# EAGLE design ZxUartAdapter (EAGLE 9.2.2)
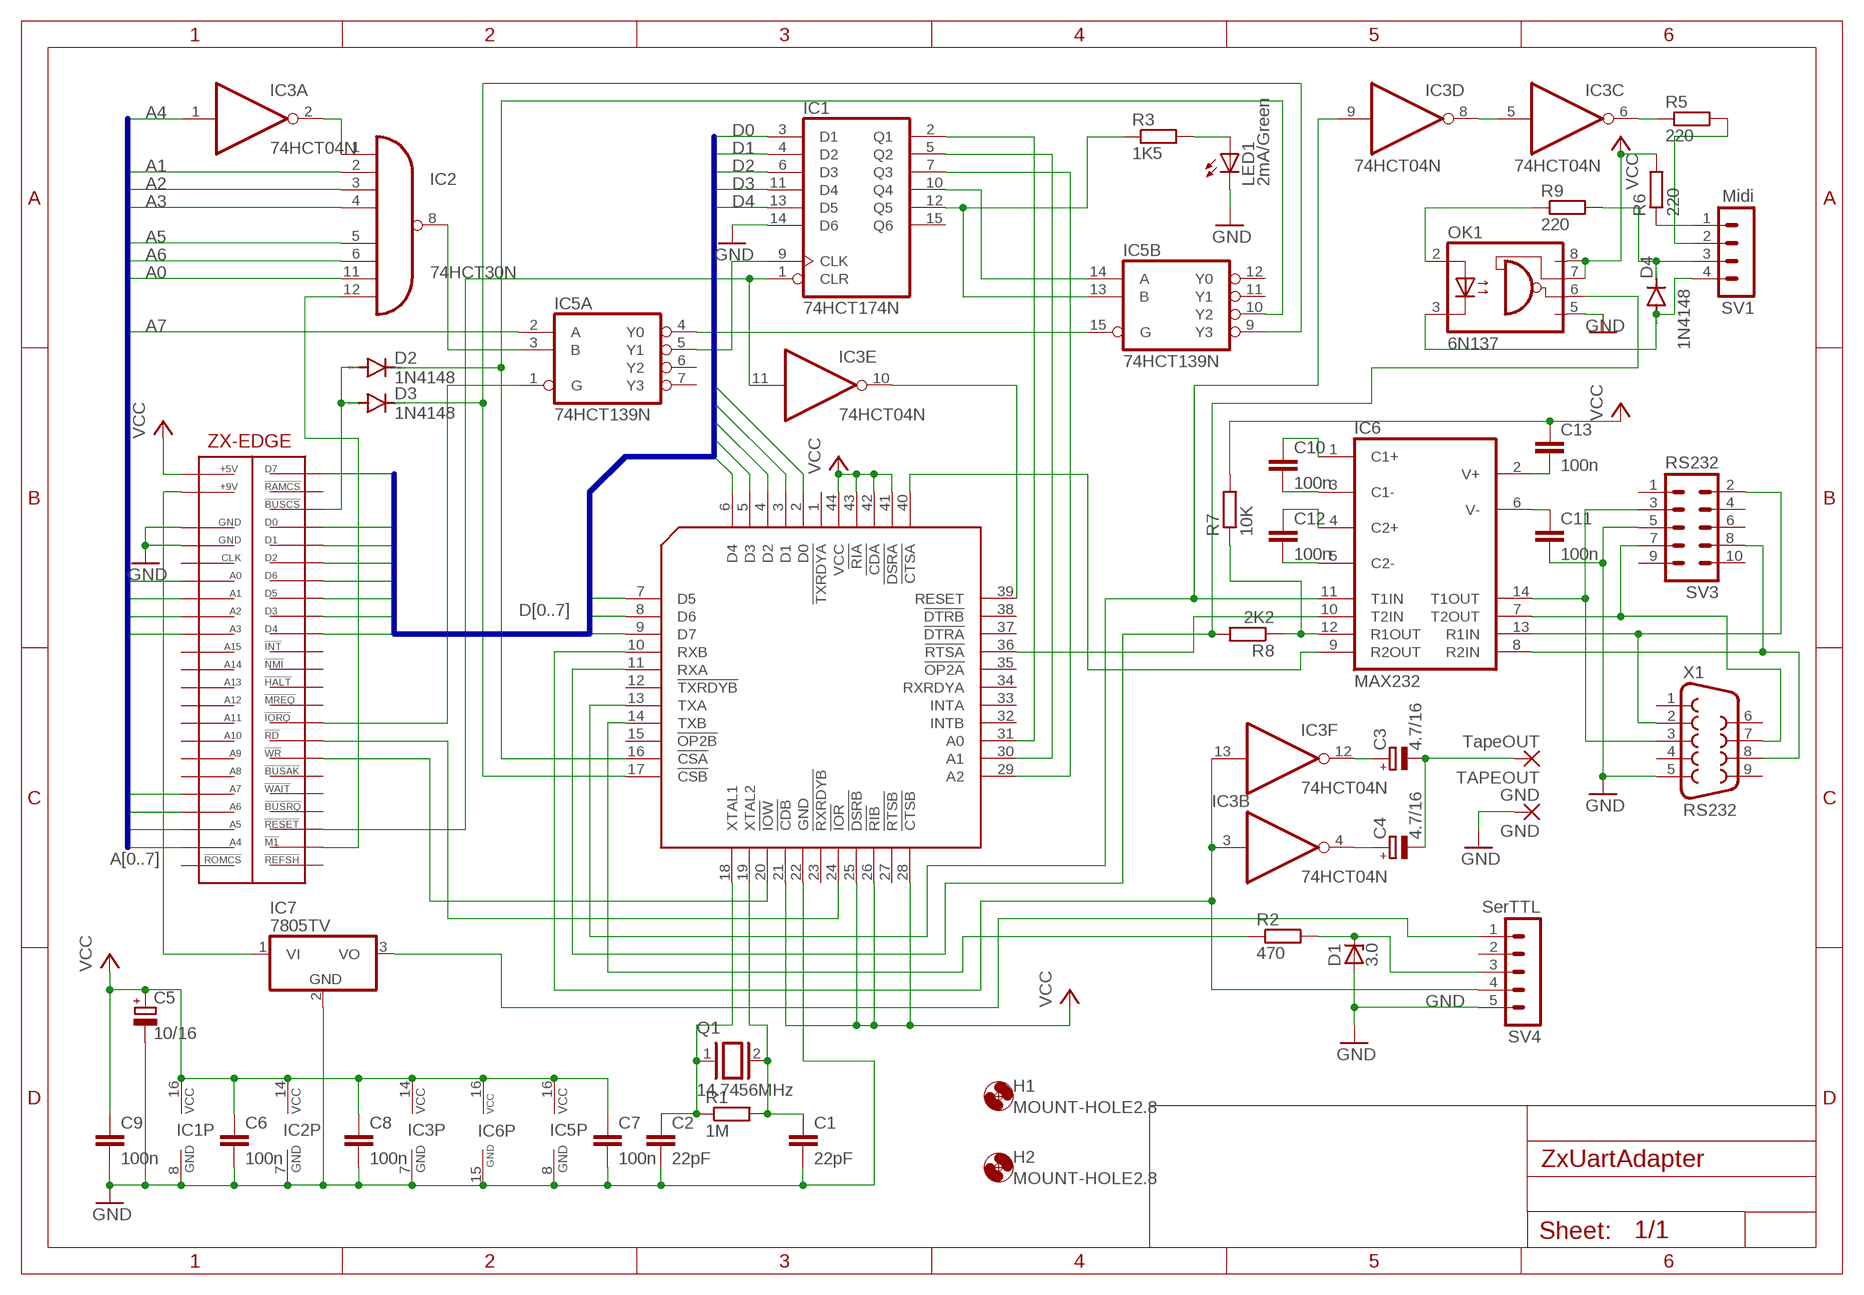
[diagram p0: schematic, sheet 1]

## Parts
C1  22pF  C-EU025-025X050  [C025-025X050]
C2  22pF  C-EU025-025X050  [C025-025X050]
C3  4.7/16  CPOL-EUE5-5  [E5-5]
C4  4.7/16  CPOL-EUE5-5  [E5-5]
C5  10/16  CPOL-EUE5-6  [E5-6]
C6  100n  C-EU050-024X044  [C050-024X044]
C7  100n  C-EU050-024X044  [C050-024X044]
C8  100n  C-EU050-024X044  [C050-024X044]
C9  100n  C-EU050-024X044  [C050-024X044]
C10  100n  C-EU050-024X044  [C050-024X044]
C11  100n  C-EU050-024X044  [C050-024X044]
C12  100n  C-EU050-024X044  [C050-024X044]
C13  100n  C-EU050-024X044  [C050-024X044]
D1  3.0  ZENER-DIODEZD-7.5  [ZDIO-7.5]
D2  1N4148  1N4148DO35-7  [DO35-7]
D3  1N4148  1N4148DO35-7  [DO35-7]
D4  1N4148  1N4148DO35-7  [DO35-7]
GND  GND  2,15/1,0  [2,15/1,0]
H1  MOUNT-HOLE2.8  [2,8]
H2  MOUNT-HOLE2.8  [2,8]
IC1  74HCT174N  [DIL16]
IC2  74HCT30N  [DIL14]
IC3  74HCT04N  [DIL14]
IC4  XR16C2850  XR16C2850PLCC44S  [S44]
IC5  74HCT139N  [DIL16]
IC6  MAX232  [DIL16]
IC7  7805TV  [TO220V]
LED1  2mA/Green  LED3MM  [LED3MM]
OK1  6N137  [DIL08]
Q1  14.7456MHz  XTAL/S  [QS]
R1  1M  R-EU_0207/12  [0207/12]
R2  470  R-EU_0207/12  [0207/12]
R3  1K5  R-EU_0207/12  [0207/12]
R5  220  R-EU_0207/12  [0207/12]
R6  220  R-EU_0207/12  [0207/12]
R7  10K  R-EU_0207/12  [0207/12]
R8  2K2  R-EU_0207/12  [0207/12]
R9  220  R-EU_0207/12  [0207/12]
SV1  Midi  MA04-1  [MA04-1]
SV3  RS232  MA05-2  [MA05-2]
SV4  SerTTL  MA05-1  [MA05-1]
TAPEOUT  TapeOUT  2,15/1,0  [2,15/1,0]
U$1  ZX-EDGEZX96  [ZX-EDGE64]
X1  RS232  F09HP  [F09HP]

## Nets
A0: IC2.11(I6) U$1.A21(A0)
A1: IC2.2(I1) U$1.A20(A1)
A2: IC2.3(I2) U$1.A19(A2)
A3: IC2.4(I3) U$1.A18(A3)
A4: IC3.1(A:I) U$1.A6(A4)
A5: IC2.5(I4) U$1.A7(A5)
A6: IC2.6(I5) U$1.A8(A6)
A7: IC5.2(A:A) U$1.A9(A7)
D0: IC1.3(D1) IC4.2(D0) U$1.C24(D0)
D1: IC1.4(D2) IC4.3(D1) U$1.C23(D1)
D2: IC1.6(D3) IC4.4(D2) U$1.C22(D2)
D3: IC1.11(D4) IC4.5(D3) U$1.C19(D3)
D4: IC1.13(D5) IC4.6(D4) U$1.C18(D4)
D5: IC4.7(D5) U$1.C20(D5)
D6: IC4.8(D6) U$1.C21(D6)
D7: IC4.9(D7) U$1.C27(D7)
GND: C1.2 C2.2 C5.- C6.2 C7.2 C8.2 C9.2 C11.2 D1.A GND.1(P) IC1.8(GND) IC1.14(D6) IC2.7(GND) IC3.7(P:GND) IC4.22(GND) IC5.8(P:GND) IC6.15(GND) IC7.2(GND) LED1.K(C) OK1.5(GND) SV3.5 SV4.5 U$1.A23(GND2) U$1.A24(GND1) X1.5
N$1: IC2.1(I0) IC3.2(A:O)
N$2: IC2.12(I7) U$1.C6(!M1)
N$3: IC5.1(A:G) U$1.C13(!IORQ)
N$4: IC2.8(O) IC5.3(A:B)
N$5: IC1.9(CLK) IC5.5(A:Y1)
N$6: IC5.4(A:Y0) IC5.15(B:G)
N$7: IC1.10(Q4) IC5.14(B:A)
N$8: IC1.12(Q5) IC5.13(B:B) R3.1
N$9: IC1.1(CLR) IC3.11(E:I) U$1.C7(!RESET)
N$10: C13.2 IC6.2(V+)
N$11: IC1.2(Q1) IC4.31(A0)
N$12: IC1.5(Q2) IC4.30(A1)
N$13: IC1.7(Q3) IC4.29(A2)
N$14: C11.1 IC6.6(V-)
N$15: IC3.10(E:O) IC4.39(RESET)
N$16: D2.C IC4.16(!CSA) IC5.10(B:Y2)
N$17: D3.C IC4.17(!CSB) IC5.9(B:Y3)
N$18: IC4.20(!IOW) U$1.C11(!WR)
N$19: IC4.24(!IOR) U$1.C12(!RD)
N$20: C1.1 IC4.19(XTAL2) Q1.2 R1.2
N$21: C2.1 IC4.18(XTAL1) Q1.1 R1.1
N$22: D2.A D3.A U$1.C25(!BUSCS)
N$23: C10.2 IC6.3(C1-)
N$24: C10.1 IC6.1(C1+)
N$25: C12.2 IC6.5(C2-)
N$26: C12.1 IC6.4(C2+)
N$27: IC4.14(TXB) R2.1
N$28: IC6.13(R1IN) SV3.2 X1.2
N$29: IC3.9(D:I) IC4.13(TXA) IC6.11(T1IN)
N$30: IC3.5(C:I) IC3.8(D:O)
N$31: D4.A OK1.3(C) SV1.4
N$32: IC3.6(C:O) R5.1
N$33: R6.1 SV1.1
N$34: R5.2 SV1.2
N$35: IC4.11(RXA) OK1.6(VO) R8.2
N$36: IC6.12(R1OUT) R7.1 R8.1
N$37: OK1.2(A) R9.1
N$38: D4.C R9.2 SV1.3
N$39: C3.+ IC3.12(F:O)
N$40: C4.+ IC3.4(B:O)
N$41: C3.- C4.- TAPEOUT.1(P)
N$42: IC3.3(B:I) IC3.13(F:I) IC4.10(RXB) SV4.4
N$43: D1.C R2.2 SV4.3
N$44: IC4.36(!RTSA) IC6.10(T2IN)
N$46: IC6.14(T1OUT) SV3.3 X1.3
N$47: IC6.7(T2OUT) SV3.7 X1.7
N$50: IC6.8(R2IN) SV3.8 X1.8
N$51: IC4.40(!CTSA) IC6.9(R2OUT)
N$52: LED1.A R3.2
N$54: IC7.1(VI) U$1.A26(+9)
N$55: IC7.3(VO) SV4.1
VCC: C5.+ C6.1 C7.1 C8.1 C9.1 C13.1 IC1.16(VCC) IC2.14(VCC) IC3.14(P:VCC) IC4.21(!CDB) IC4.25(!DSRB) IC4.26(!RIB) IC4.28(!CTSB) IC4.41(!DSRA) IC4.42(!CDA) IC4.43(!RIA) IC4.44(VCC) IC5.16(P:VCC) IC6.16(VCC) OK1.7(VE) OK1.8(VCC) R6.2 R7.2 U$1.A27(+5)
Unconnected: IC1.15(Q6) IC4.1(!TXRDYA) IC4.12(!TXRDYB) IC4.15(!OP2B) IC4.23(!RXRDYB) IC4.27(!RTSB) IC4.32(INTB) IC4.33(INTA) IC4.34(RXRDYA) IC4.35(!OP2A) IC4.37(!DTRA) IC4.38(!DTRB) IC5.6(A:Y2) IC5.7(A:Y3) IC5.11(B:Y1) IC5.12(B:Y0) SV3.1 SV3.4 SV3.6 SV3.9 SV3.10 SV4.2 U$1.A5(!ROMCS) U$1.A10(A8) U$1.A11(A9) U$1.A12(A10) U$1.A13(A11) U$1.A14(A12) U$1.A15(A13) U$1.A16(A14) U$1.A17(A15) U$1.A22(CLK) U$1.C5(!REFSH) U$1.C8(!BUSRQ) U$1.C9(!WAIT) U$1.C10(!BUSAK) U$1.C14(!MREQ) U$1.C15(!HALT) U$1.C16(!NMI) U$1.C17(!INT) U$1.C26(!RAMCS) X1.1 X1.4 X1.6 X1.9

## Buses
A[0..7]
D[0..7]

## Library data of the parts
C1 C2 C6-C13 = rcl:C-EU: CAPACITOR, European symbol; SPICEPREFIX: C
C3-C5 = rcl:CPOL-EU: POLARIZED CAPACITOR, European symbol; SPICEPREFIX: C
D1 = diode:ZENER-DIODE: Z-Diode
D2-D4 = diode:1N4148: DIODE high speed (Philips)
GND TAPEOUT = wirepad:2,15/1,0: THROUGH-HOLE PAD
H1 H2 = holes:MOUNT-HOLE: MOUNTING HOLE with drill center marker
IC1 = 74xx-eu:74*174: Hex D type FLIP FLOP, clear
IC2 = 74xx-eu:74*30: 8-input NAND gate
IC3 = 74xx-eu:74*04: Hex INVERTER
IC4 = Exar_XR16C2850:XR16C2850: Exar XR16C2850
IC5 = 74xx-eu:74*139: Dual 2-line to 4-line DECODER/DEMULTIPLEXER
IC6 = maxim:MAX232: RS232 TRANSCEIVER; MF: MAXIM; MPN: MAX232ACPE+; OC_FARNELL: 9723773; OC_NEWARK: 68K4544
IC7 = linear:78*: Positive VOLTAGE REGULATOR Source: http://cache.national.com/ds/LM/LM78L05.pdf http://www.fairchildsemi.com/ds/LM/LM7805.pdf
LED1 = led:LED: LED OSRAM: - CHIPLED LG R971, LG N971, LY N971, LG Q971, LY Q971, LO R971, LY R971 LH N974, LH R974 LS Q976, LO Q976, LY Q976 LO Q996 - Hyper CHIPLED LW Q18S LB Q993, LB Q99A, LB R99A - SideLED LS A670, LO A670, LY A670, LG A670, LP A670 LB A673, LV A673, LT A673, LW A673 LH A674 LY A675 LS A676, LA A676, LO A676, LY A676, LW A676 LS A679, LY A679, LG A679 - Hyper Micro SIDELED® LS Y876, LA Y876, LO Y876, LY Y876 LT Y87S - SmartLED LW L88C, LW L88S LB L89C, LB L89S, LG L890 LS L89K, LO L89K, LY L89K LS L896, LA L896, LO L896, LY L896 - TOPLED LS T670, LO T670, LY T670, LG T670, LP T670 LSG T670, LSP T670, LSY T670, LOP T670, LYG T670 LG T671, LOG T671, LSG T671 LB T673, LV T673, LT T673, LW T673 LH T674 LS T676, LA T676, LO T676, LY T676, LB T676, LH T676, LSB T676, LW T676 LB T67C, LV T67C, LT T67C, LS T67K, LO T67K, LY T67K, LW E67C LS E67B, LA E67B, LO E67B, LY E67B, LB E67C, LV E67C, LT E67C LW T67C LS T679, LY T679, LG T679 LS T770, LO T770, LY T770, LG T770, LP T770 LB T773, LV T773, LT T773, LW T773 LH T774 LS E675, LA E675, LY E675, LS T675 LS T776, LA T776, LO T776, LY T776, LB T776 LHGB T686 LT T68C, LB T68C - Hyper Mini TOPLED® LB M676 - Mini TOPLED Santana® LG M470 LS M47K, LO M47K, LY M47K Source: http://www.osram.convergy.de LUXEON: - LUMILED® LXK2-PW12-R00, LXK2-PW12-S00, LXK2-PW14-U00, LXK2-PW14-V00 LXK2-PM12-R00, LXK2-PM12-S00, LXK2-PM14-U00 LXK2-PE12-Q00, LXK2-PE12-R00, LXK2-PE12-S00, LXK2-PE14-T00, LXK2-PE14-U00 LXK2-PB12-K00, LXK2-PB12-L00, LXK2-PB12-M00, LXK2-PB14-N00, LXK2-PB14-P00, LXK2-PB14-Q00 LXK2-PR12-L00, LXK2-PR12-M00, LXK2-PR14-Q00, LXK2-PR14-R00 LXK2-PD12-Q00, LXK2-PD12-R00, LXK2-PD12-S00 LXK2-PH12-R00, LXK2-PH12-S00 LXK2-PL12-P00, LXK2-PL12-Q00, LXK2-PL12-R00 Source: www.luxeon.com KINGBRIGHT: KA-3528ASYC Source: www.kingbright.com
OK1 = optocoupler:6N137: MOTOROLA OPTO COUPLER; MPN: 6N137; OC_FARNELL: 1328376; OC_NEWARK: 52M1895
Q1 = special:XTAL/S: CRYSTAL
R1-R3 R5-R9 = rcl:R-EU_: RESISTOR, European symbol; SPICEPREFIX: R
SV1 = con-lstb:MA04-1: PIN HEADER; OC_FARNELL: unknown; OC_NEWARK: unknown
SV3 = con-lstb:MA05-2: PIN HEADER; OC_FARNELL: unknown; OC_NEWARK: unknown
SV4 = con-lstb:MA05-1: PIN HEADER; OC_FARNELL: unknown; OC_NEWARK: unknown
U$1 = sinclair:ZX-EDGE: ZX80/81 and clone edge connector
X1 = con-subd:F09: SUB-D; OC_FARNELL: unknown; OC_NEWARK: unknown

## Board
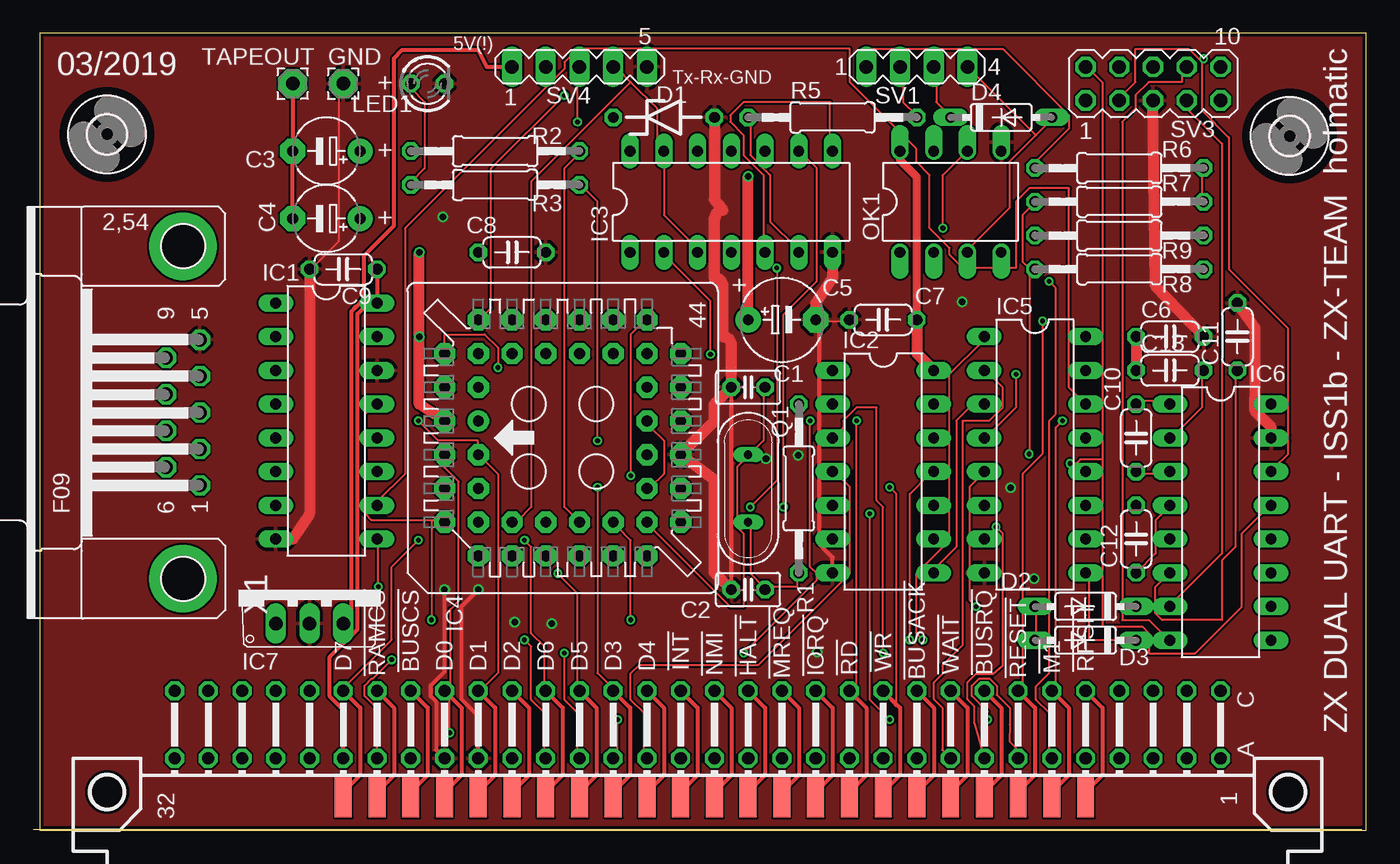
[diagram p1: board, top side]
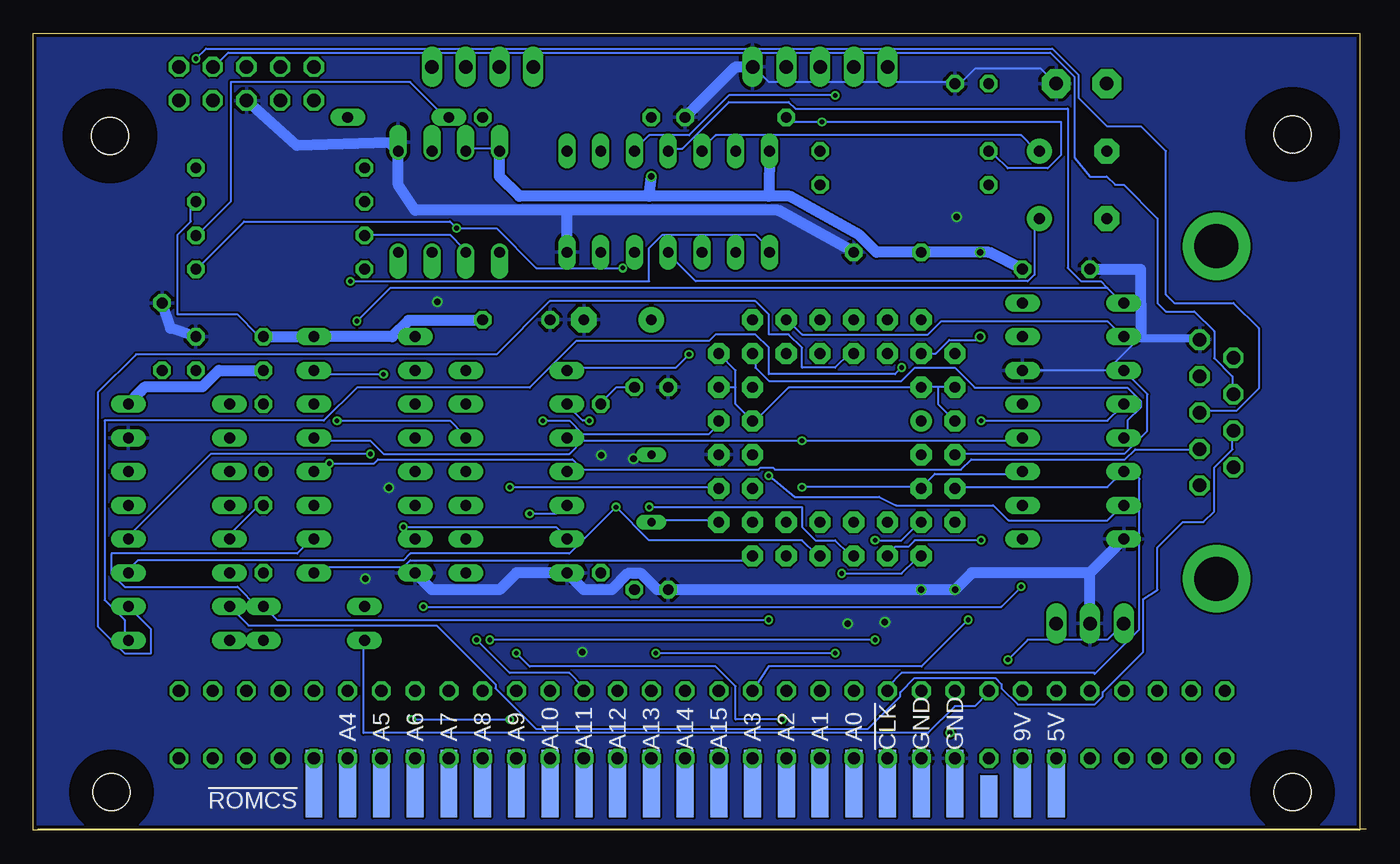
[diagram p2: board, bottom side, seen from below]

Size 99.87 x 60.03 mm. Coordinates in mm from the lower left corner, seen from the top.
Outline: 0,0 99.87,0 99.87,60.03 0,60.03 0,0
Copper layers (1*16): Top 0.035mm / dielectric 1.5mm / Bottom 0.035mm
Design rules "Seeed2layer": minimum track width 6mil, minimum drill 12mil, track to track 6mil, track to pad 6mil, pad to pad 6mil, via to via 6mil, smd to smd 0mil, copper to edge 10mil, drill to drill 10mil, minimum pad ring 10mil, minimum via ring 6mil, stop-mask expansion 2mil, vias tented up to drill 100mil, thermal gap 10mil

### Footprints (pad centres in the part's own frame; a part is rotated, then mirrored left to right if it is on the bottom)
C025-025X050 = drill 0.813 octagon: 1 -1.27,0; 2 1.27,0
E5-5 = drill 0.813 pad 1.905: + -2.54,0 | drill 0.813 pad 1.905 octagon: - 2.54,0
E5-6 = drill 0.813 pad 1.905: + -2.54,0 | drill 0.813 pad 1.905 octagon: - 2.54,0
C050-024X044 = drill 0.813 octagon: 1 -2.54,0; 2 2.54,0
ZDIO-7.5 = drill 0.813 octagon: A 3.81,0; C -3.81,0
DO35-7 = drill 0.813 long: A 3.81,0; C -3.81,0
2,15/1,0 = drill 1.016 pad 2.159 octagon: 1 0,0
2,8 = hole 2.8: 0,0
DIL16 = drill 0.813 long: 1 -8.89,-3.81; 2 -6.35,-3.81; 3 -3.81,-3.81; 4 -1.27,-3.81; 5 1.27,-3.81; 6 3.81,-3.81; 7 6.35,-3.81; 8 8.89,-3.81; 9 8.89,3.81; 10 6.35,3.81; 11 3.81,3.81; 12 1.27,3.81; 13 -1.27,3.81; 14 -3.81,3.81; 15 -6.35,3.81; 16 -8.89,3.81
DIL14 = drill 0.813 long: 1 -7.62,-3.81; 2 -5.08,-3.81; 3 -2.54,-3.81; 4 0,-3.81; 5 2.54,-3.81; 6 5.08,-3.81; 7 7.62,-3.81; 8 7.62,3.81; 9 5.08,3.81; 10 2.54,3.81; 11 0,3.81; 12 -2.54,3.81; 13 -5.08,3.81; 14 -7.62,3.81
S44 = drill 0.813 pad 1.6: 1 1.27,5.08 | drill 0.813 pad 1.6 octagon: 2 -1.27,7.62; 3 -1.27,5.08; 4 -3.81,7.62; 5 -3.81,5.08; 6 -6.35,7.62; 7 -8.89,5.08; 8 -6.35,5.08; 9 -8.89,2.54; 10 -6.35,2.54; 11 -8.89,0; 12 -6.35,0; 13 -8.89,-2.54; 14 -6.35,-2.54; 15 -8.89,-5.08; 16 -6.35,-5.08; 17 -8.89,-7.62; 18 -6.35,-10.16; 19 -6.35,-7.62; 20 -3.81,-10.16; 21 -3.81,-7.62; 22 -1.27,-10.16; 23 -1.27,-7.62; 24 1.27,-10.16; 25 1.27,-7.62; 26 3.81,-10.16; 27 3.81,-7.62; 28 6.35,-10.16; 29 8.89,-7.62; 30 6.35,-7.62; 31 8.89,-5.08; 32 6.35,-5.08; 33 8.89,-2.54; 34 6.35,-2.54; 35 8.89,0; 36 6.35,0; 37 8.89,2.54; 38 6.35,2.54; 39 8.89,5.08; 40 6.35,7.62; 41 6.35,5.08; 42 3.81,7.62; 43 3.81,5.08; 44 1.27,7.62
TO220V = drill 1.016 long: 1 -2.54,-2.54; 2 0,-2.54; 3 2.54,-2.54
LED3MM = drill 0.813 octagon: A -1.27,0; K 1.27,0
DIL08 = drill 0.813 offset: 1 -3.81,-3.81; 2 -1.27,-3.81; 3 1.27,-3.81; 4 3.81,-3.81; 5 3.81,3.81; 6 1.27,3.81; 7 -1.27,3.81; 8 -3.81,3.81
QS = drill 0.61 long: 1 -2.54,0; 2 2.54,0
0207/12 = drill 0.813 octagon: 1 -6.35,0; 2 6.35,0
MA04-1 = drill 1.016 long: 1 -3.81,0; 2 -1.27,0; 3 1.27,0; 4 3.81,0
MA05-2 = drill 1.016 octagon: 1 -5.08,-1.27; 2 -5.08,1.27; 3 -2.54,-1.27; 4 -2.54,1.27; 5 0,-1.27; 6 0,1.27; 7 2.54,-1.27; 8 2.54,1.27; 9 5.08,-1.27; 10 5.08,1.27
MA05-1 = drill 1.016 long: 1 -5.08,0; 2 -2.54,0; 3 0,0; 4 2.54,0; 5 5.08,0
ZX-EDGE64 = drill 0.914 octagon: A1 -5.08,38.1; A2 -5.08,35.56; A3 -5.08,33.02; A4 -5.08,30.48; A5 -5.08,27.94; A6 -5.08,25.4; A7 -5.08,22.86; A8 -5.08,20.32; A9 -5.08,17.78; A10 -5.08,15.24; A11 -5.08,12.7; A12 -5.08,10.16; A13 -5.08,7.62; A14 -5.08,5.08; A15 -5.08,2.54; A16 -5.08,0; A17 -5.08,-2.54; A18 -5.08,-5.08; A19 -5.08,-7.62; A20 -5.08,-10.16; A21 -5.08,-12.7; A22 -5.08,-15.24; A23 -5.08,-17.78; A24 -5.08,-20.32; A25 -5.08,-22.86; A26 -5.08,-25.4; A27 -5.08,-27.94; A28 -5.08,-30.48; A29 -5.08,-33.02; A30 -5.08,-35.56; A31 -5.08,-38.1; A32 -5.08,-40.64; C1 -10.16,38.1; C2 -10.16,35.56; C3 -10.16,33.02; C4 -10.16,30.48; C5 -10.16,27.94; C6 -10.16,25.4; C7 -10.16,22.86; C8 -10.16,20.32; C9 -10.16,17.78; C10 -10.16,15.24; C11 -10.16,12.7; C12 -10.16,10.16; C13 -10.16,7.62; C14 -10.16,5.08; C15 -10.16,2.54; C16 -10.16,0; C17 -10.16,-2.54; C18 -10.16,-5.08; C19 -10.16,-7.62; C20 -10.16,-10.16; C21 -10.16,-12.7; C22 -10.16,-15.24; C23 -10.16,-17.78; C24 -10.16,-20.32; C25 -10.16,-22.86; C26 -10.16,-25.4; C27 -10.16,-27.94; C28 -10.16,-30.48; C29 -10.16,-33.02; C30 -10.16,-35.56; C31 -10.16,-38.1; C32 -10.16,-40.64 | smd 5.08 x 1.27 bottom: P$1 -3.175,-25.4; P$2 -3.175,-27.94; P$15 -3.175,-20.32; P$27 -3.175,-17.78; P$28 -3.175,-15.24; P$29 -3.175,-12.7; P$30 -3.175,-10.16; P$31 -3.175,-7.62; P$32 -3.175,-5.08; P$33 -3.175,-2.54; P$34 -3.175,0; P$35 -3.175,2.54; P$36 -3.175,5.08; P$37 -3.175,7.62; P$38 -3.175,10.16; P$39 -3.175,12.7; P$40 -3.175,15.24; P$41 -3.175,17.78; P$42 -3.175,20.32; P$43 -3.175,22.86; P$44 -3.175,25.4; P$45 -3.175,27.94 | smd 3.175 x 1.27: P$3 -2.223,-27.94; P$4 -2.223,-25.4; P$5 -2.223,-22.86; P$6 -2.223,-20.32; P$7 -2.223,-17.78; P$8 -2.223,27.94; P$9 -2.223,25.4; P$10 -2.223,22.86; P$11 -2.223,20.32; P$12 -2.223,17.78; P$13 -2.223,15.24; P$14 -2.223,12.7; P$16 -2.223,10.16; P$17 -2.223,7.62; P$18 -2.223,5.08; P$19 -2.223,2.54; P$20 -2.223,0; P$21 -2.223,-2.54; P$22 -2.223,-5.08; P$23 -2.223,-7.62; P$24 -2.223,-10.16; P$25 -2.223,-12.7; P$26 -2.223,-15.24 | smd 3.175 x 1.27 bottom: P$46 -2.223,-22.86 | hole 2.794: -2.54,43.18; -2.54,-45.72
F09HP = drill 1.016 octagon: 1 -5.486,-1.27; 2 -2.743,-1.27; 3 0,-1.27; 4 2.743,-1.27; 5 5.486,-1.27; 6 -4.115,1.27; 7 -1.372,1.27; 8 1.372,1.27; 9 4.115,1.27 | drill 3.302 pad 5.08: G1 -12.522,0; G2 12.522,0

### Placement (x,y rotation side)
C1  53.34,33.37 180 top
C2  53.34,18.13 180 top
C3  21.59,51.15 180 top
C4  21.59,46.07 180 top
C5  55.88,38.45 0 top
C6  85.09,37.18 0 top
C7  63.5,38.45 180 top
C8  35.56,43.53 0 top
C9  22.86,42.26 180 top
C10  82.55,29.56 270 top
C11  90.17,37.18 90 top
C12  82.55,21.94 90 top
C13  85.09,34.64 0 top
D1  46.99,53.69 0 top
D2  78.74,16.86 180 top
D3  78.74,14.32 180 top
D4  72.39,53.69 0 top
GND  22.86,56.23 0 top
H1  5.08,52.42 0 top
H2  94.11,52.29 0 top
IC1  21.59,30.83 270 top
IC2  63.5,27.02 270 top
IC3  52.07,47.34 0 top
IC4  38.1,29.56 90 top
IC5  74.93,28.29 270 top
IC6  88.9,23.21 270 top
IC7  20.32,18.13 0 top
LED1  29.21,56.23 0 top
OK1  68.58,47.34 0 top
Q1  53.34,25.75 90 top
R1  57.15,25.75 90 top
R2  34.29,51.15 180 top
R3  34.29,48.61 180 top
R5  59.69,53.69 0 top
R6  81.28,49.88 0 top
R7  81.28,47.34 0 top
R8  81.28,42.26 0 top
R9  81.28,44.8 0 top
SV1  66.04,57.5 0 top
SV3  83.82,56.23 0 top
SV4  40.64,57.5 0 top
TAPEOUT  19.05,56.23 0 top
U$1  50.8,0.35 270 top
X1  10.79,31.46 90 top

### Tracks (layer width: path | path; a pad name or v marks a point on that pad's centre or on a via)
A0  (via drill 0.35)
  Top 0.152: v65.5,14.35 65.5,25.35 67,26.85 IC2.11 | v36.5,14.35 37,13.85 37,9.85 38,8.85 38,5.85 U$1.A21
  Bottom 0.152: v36.5,14.35 v65.5,14.35
A1  (via drill 0.35)
  Top 0.152: v58,30.85 58,19.85 58.5,19.35 58.5,18.85 v53,13.35 | v39.5,13.35 39.5,9.85 40.5,8.85 40.5,5.85 U$1.A20
  Bottom 0.152: v58,30.85 58.5,30.85 59.5,31.85 IC2.2 | v39.5,13.35 v53,13.35
A2  (via drill 0.35)
  Top 0.152: v63.5,13.35 63.5,24.35 63,24.85 63,31.85 61.5,31.85 60.5,30.85 60.5,30.35 60,29.85 IC2.3 | v43.5,8.35 43.5,5.85 U$1.A19
  Bottom 0.152: v63.5,13.35 62.5,12.35 48.5,12.35 47,10.85 47,8.35 v43.5,8.35
A3
  Top 0.152: IC2.4 60,26.85 61,25.85 61,19.35 54.13,12.48 45.16,12.48 44.5,11.83 44.5,9.85 45.5,8.85 45.5,5.85 U$1.A18
A4  (via drill 0.35)
  Top 0.152: v76,41.35 76.5,40.85 76.5,31.35 76,30.85 76,11.85 75,10.85 75,9.85 76,8.85 76,5.85 U$1.A6
  Bottom 0.152: v76,41.35 53.5,41.35 53.5,43.85 52.5,44.85 45.5,44.85 44.5,43.85 IC3.1
A5  (via drill 0.35)
  Top 0.152: v62.5,23.85 62.5,9.85 v64,8.35 | U$1.A7 73.5,5.85 73.5,6.21 73.02,6.69 73.03,7.97 73.03,9.24 72.06,10.21 72.06,10.9 71.51,11.45 70.73,11.45 70.18,10.9 70.18,10.12 71.36,8.94 v71.36,8.35
  Bottom 0.152: v62.5,23.85 60.5,23.85 60,24.35 IC2.5 | v71.36,8.35 v64,8.35
A6  (via drill 0.35)
  Top 0.152: v72,22.85 72.5,22.35 72.5,12.41 71.75,11.78 70.48,11.78 69.85,11.14 69.85,9.88 70.36,9.36 70.36,8.07 U$1.A8
  Bottom 0.152: v72,22.85 60.5,22.85 60,22.35 IC2.6
A7
  Top 0.152: U$1.A9 67.94,6.06 67.94,9.24 67.31,9.88 67.31,11.14 67.94,11.78 67.94,12.41 69.5,13.97 69.5,30.85 71.5,30.85 72.5,31.85 72.5,33.35 71.5,34.35 IC5.2
D0  (via drill 0.35)
  Top 0.152: v30.86,7.35 30.86,10.07 U$1.C24 30.63,10.56 30.94,10.87 30.94,16.66 31.55,17.27 31.55,26.26 30.48,27.33 IC4.2
  Bottom 0.152: IC1.3 17.5,34.35 16,32.85 16,32.81 16,30.07 17.68,28.39 30.02,28.39 IC4.2
D1  (via drill 0.35)
  Top 0.152: v28.5,30.85 30,29.35 33,29.35 33,28.35 IC4.3 33.5,27.85 34.5,26.85 34.5,11.85 33.5,10.85 U$1.C23
  Bottom 0.152: v28.5,30.85 19,30.85 18,31.85 IC1.4
D2
  Bottom 0.152: IC4.4 30,25.85 19,25.85 18,26.85 IC1.6 17.5,26.85 16.98,26.85 16.57,26.45 16.61,26.41 16.61,15.13 19.96,11.78 20,11.85 34.5,11.85 35.5,10.85 U$1.C22
D3  (via drill 0.35)
  Top 0.152: v42,25.85 42,11.85 43,10.85 U$1.C19
  Bottom 0.152: IC1.11 25.5,26.85 32,26.85 33,25.85 IC4.5 33.5,25.85 v42,25.85
D4  (via drill 0.35)
  Top 0.152: 29.5,23.35 30,23.35 IC4.6 | 29.5,23.35 25,23.35 24.5,23.85 24.5,31.35 25,31.85 IC1.13 | 29.5,23.35 v29.5,15.85
  Bottom 0.152: U$1.C18 44.53,12.35 33,12.35 v29.5,15.85
D5  (via drill 0.35)
  Top 0.152: v39,19.35 40.5,17.85 40.5,10.85 U$1.C20
  Bottom 0.152: v39,19.35 34.5,19.35 33.5,20.35 IC4.7
D6  (via drill 0.35)
  Top 0.152: v36.5,21.85 37,21.35 37,14.85 38,13.85 38,10.85 U$1.C21
  Bottom 0.152: v36.5,21.85 34.5,21.85 33.5,22.85 IC4.8
D7  (via drill 0.35)
  Top 0.152: v28.5,21.85 26.5,19.85 26.5,14.35 23,10.85 U$1.C27
  Bottom 0.152: v28.5,21.85 33.5,21.85 34,21.35 35,21.35 35.5,20.85 IC4.9
GND  (via drill 0.5)
  Top 0.152: C9.2 20.5,42.35 22.5,44.35 22.5,55.85 GND.1 | C7.2 60.5,38.35 58.5,38.35 C5.-
  Top 0.305: U$1.A23 33.02,8.62 31.75,9.89 31.75,16.86 v33.02,18.13 | U$1.A24 29.84,6.06 29.84,9.71 29.46,10.09 29.46,10.93 30.48,11.95 v30.48,18.13 | C2.2 C1.2 | IC2.7 59.69,20.58 58.73,21.54 58.73,38.15 C5.-
  Top 0.813: IC3.7 59.69,41.62 58.42,39.72 C5.- | C2.2 50.8,19.4 50.8,26.39 IC4.22 50.8,30.83 50.8,32.1 C1.2 52.07,36.55 arc90 51.44,37.18 51.44,40.99 arc90 50.8,41.62 50.8,46.07 arc-90 50.85,46.12 arc-90 51.44,46.7 50.8,47.5 D1.A | C9.2 20.32,23.85 19.05,21.94 IC1.8 | IC6.15 92.71,30.38 91.49,31.6 91.49,32.61 91.5,32.61 91.5,37.82 C11.2 | C6.2 84,40.99 SV3.5
  Bottom 0.152: GND.1 23,56.35 24,57.35 29,57.35 30,56.35 LED1.K 30.5,56.35 44.5,56.35 45.5,57.35 SV4.5 | 60,46.7 60,43.85 IC3.7 | IC1.14 19.04,34.64 16.5,37.18 16.15,37.08 12.19,37.08 12.18,37.07 X1.5
  Bottom 0.61: 16.5,37.18 16.39,37.07 12.18,37.07
  Bottom 0.813: IC7.2 20.32,19.4 | 20.32,19.4 IC1.8 | 20.32,19.4 29.21,19.4 v30.48,18.13 v33.02,18.13 C2.2 52.89,18.13 54.1,19.35 55.12,19.35 56.33,18.13 58.42,18.13 IC2.7 63.5,19.4 64.77,18.13 69.85,18.13 IC5.8 | C8.2 43.81,46.7 59.69,46.7 | 59.69,46.7 60,46.7 71.12,46.7 72.39,48.61 OK1.5 73.03,51.79 80.02,51.58 SV3.5 | C9.2 16.51,42.26 16.5,37.18 | D1.A 46.99,57.5 SV4.5 | C6.2 89.53,37.82 C11.2 | IC3.7 59.69,46.7
  other vias: 30.35,46.2 69.44,39.8 57.1,28.25 54.69,28 74.87,18.95 58.54,13.43 38.55,15.58 35.76,15.69 73.09,25.81
  pour Top: 0,0.35 0,60.35 100,60.35 100,0.35
  pour Bottom: 0,0.35 0,60.35 100,60.35 100,0.35
N$1  (via drill 0.35)
  Top 0.152: v50.5,35.85 50.5,39.85 47,43.35 IC3.2
  Bottom 0.152: v50.5,35.85 51.5,34.85 59.5,34.85 IC2.1
N$2  (via drill 0.35)
  Top 0.152: v77,30.85 76.5,30.35 76.5,10.85 U$1.C6
  Bottom 0.152: v77,30.85 68.5,30.85 67.5,29.85 IC2.12
N$3  (via drill 0.35)
  Top 0.152: v66.5,14.35 66,14.85 66,19.35 68.5,21.85 68.5,34.35 71,36.85 IC5.1
  Bottom 0.152: v66.5,14.35 64,11.85 59.5,11.85 58.5,10.85 U$1.C13
N$4
  Top 0.152: IC2.8 67.5,19.85 69,21.35 69,30.85 70,31.85 71,31.85 IC5.3
N$5  (via drill 0.35)
  Top 0.152: v25.5,18.35 25.5,21.85 IC1.9 | v70.5,16.85 70,17.35 70,25.85 71,26.85 IC5.5
  Bottom 0.152: v25.5,18.35 27,16.85 v70.5,16.85
N$6  (via drill 0.35)
  Top 0.152: v73.5,34.35 73.5,31.85 71.5,29.85 IC5.4
  Bottom 0.152: v73.5,34.35 78.5,34.35 IC5.15
N$7
  Top 0.152: IC1.10 25.5,24.85 27.5,26.85 27.5,45.35 39.5,57.35 39.5,57.85 40.5,58.85 61,58.85 61,56.35 66,51.35 66,50.35 67,49.35 67,45.35 68.5,43.85 68.5,43.35 69.5,42.35 73.5,42.35 73.5,47.35 74.5,48.35 77.5,48.35 77.5,33.35 78.5,32.35 IC5.14
N$8  (via drill 0.35)
  Top 0.152: v42,29.35 42,47.35 41,48.35 R3.1
  Bottom 0.152: IC1.12 25.5,29.35 v42,29.35 58.5,29.35 59.5,28.35 73.5,28.35 74.5,29.35 78.5,29.35 IC5.13
N$9  (via drill 0.35)
  Top 0.152: v75.5,38.35 75.5,28.35 74,26.85 74,10.85 U$1.C7
  Bottom 0.152: 19,40.85 19.5,41.35 21,41.35 22,42.35 22,54.35 42.5,54.35 43,54.85 47.5,54.85 51,51.35 52,51.35 IC3.11 | 19,40.85 18,39.85 IC1.1 | v75.5,38.35 73,40.85 19,40.85
N$10
  Top 0.152: IC6.2 85.5,29.85 87.5,31.85 87.5,34.35 C13.2
N$11
  Bottom 0.152: IC1.2 18,37.35 19,38.35 31.5,38.35 32.5,37.35 42,37.35 43,38.35 IC4.31
N$12
  Bottom 0.152: IC1.5 17.5,29.85 17.5,30.85 16.5,31.85 16.5,32.35 17.5,33.35 29,33.35 30.5,34.85 33.5,34.85 34.5,33.85 44.5,33.85 45.5,34.85 45.5,35.85 IC4.30
N$13  (via drill 0.35)
  Top 0.152: v44.5,26.71 44.5,37.35 45.5,38.35 IC4.29
  Bottom 0.152: IC1.7 18,24.35 19,23.35 26.46,23.35 27.59,24.48 34.92,24.48 36.2,25.12 42.55,25.12 v44.5,26.71
N$14
  Top 0.152: IC6.6 85,19.35 84,18.35 84,16.35 84.5,15.85 89,15.85 89,20.35 90,21.35 90,34.35 C11.1
N$15  (via drill 0.35)
  Top 0.152: v39.5,55.35 34,49.85 34,39.35 33.5,38.85 IC4.39
  Bottom 0.152: v39.5,55.35 47.5,55.35 50.5,52.35 53.5,52.35 54.5,51.35 IC3.10
N$16  (via drill 0.35)
  Top 0.152: v44.5,15.85 44.5,21.85 43.5,22.85 IC4.16
  Bottom 0.152: IC5.10 79,21.85 80,20.85 94,20.85 94,19.35 93,18.35 84.5,18.35 83,16.85 D2.C 82.5,16.85 81.5,15.85 v44.5,15.85
N$17
  Top 0.152: D3.C 82.5,14.35 79,14.35 79,19.35 IC5.9
  Bottom 0.152: IC4.17 46,20.35 71.5,20.35 72,19.85 78.5,19.85 IC5.9
N$18  (via drill 0.35)
  Top 0.152: v64,25.85 64.5,25.35 64.5,9.35 U$1.C11
  Bottom 0.152: v64,25.85 48.5,25.85 IC4.20
N$19  (via drill 0.35)
  Top 0.152: v61.5,30.85 61.5,9.85 U$1.C12
  Bottom 0.152: v61.5,30.85 59.5,30.85 58.5,29.85 49,29.85 48.5,30.35 IC4.24
N$20
  Top 0.152: C1.1 54.5,33.35 54.5,29.35 53.5,28.35 Q1.2 53,27.85 52.5,27.35 52.5,22.85 53,22.35 53,16.85 52,16.85 46,22.85 IC4.19
  Bottom 0.152: R1.2 57,32.35 56,33.35 55,33.35 C1.1
N$21
  Top 0.152: R1.1 57,19.35 57,18.35 55,18.35 C2.1 54.5,18.35 53.5,19.35 53.5,22.85 Q1.1
  Bottom 0.152: Q1.1 53,23.35 48.5,23.35 IC4.18
N$22
  Top 0.152: D3.A 75,14.35 75,16.85 D2.A
  Bottom 0.152: D3.A 75,13.85 75,7.35 32.5,7.35 30.5,9.35 29,9.35 28,10.35 U$1.C25
N$23
  Top 0.152: C10.2 83,26.85 85,26.85 IC6.3
N$24
  Top 0.152: C10.1 83,32.35 85,32.35 IC6.1
N$25
  Bottom 0.152: C12.2 83,24.35 85,22.35 IC6.5
N$26
  Top 0.152: C12.1 84,20.85 84,23.35 85,24.35 IC6.4
N$27
  Top 0.152: IC4.14 39.5,24.35 39.5,49.85 40.5,50.85 R2.1
N$28  (via drill 0.35)
  Top 0.152: 80,27.93 80,56.35 79,57.35 SV3.2 | 80,27.93 80,15.35 83,15.35 83.5,14.85 83.5,13.35 87,13.35 90.5,16.85 90.5,22.35 92.5,24.35 IC6.13 | v77.57,27.63 78.03,27.63 78.33,27.93 80,27.93
  Bottom 0.152: v77.57,27.63 74.22,27.63 73.91,27.93 59.28,27.93 58.52,27.17 45.26,27.17 45.11,27.33 44.2,27.33 44.04,27.17 30.02,27.17 29.26,27.93 17.68,27.93 16.92,28.7 12.19,28.7 X1.2
N$29  (via drill 0.35)
  Top 0.152: v56,24.35 56,38.85 58.5,41.35 58.5,49.85 57.5,50.85 IC3.9
  Bottom 0.152: IC4.13 41,20.85 42,21.85 53.5,21.85 v56,24.35 59.5,20.85 71.5,20.85 72,20.35 92,20.35 92.5,19.85 IC6.11
N$30
  Top 0.152: IC3.5 54.5,43.85 54.5,49.35 53,50.85 53,52.35 52,53.35 52,53.85 53,54.85 59.5,54.85 59.5,51.35 IC3.8
N$31
  Top 0.152: 75,52.35 76,53.35 D4.A | 75,52.35 73,50.35 73,46.85 70,43.85 OK1.3 | 75,52.35 SV1.4
N$32
  Top 0.152: IC3.6 57,43.85 55,45.85 55,49.35 53.5,50.85 53.5,53.35 R5.1
N$33
  Top 0.152: R6.1 75,50.35 77.5,52.85 77.5,53.85 72.5,58.85 62.5,58.85 62.5,57.85 SV1.1
N$34
  Top 0.152: R5.2 66,53.85 65,54.85 65,57.35 SV1.2
N$35  (via drill 0.35)
  Top 0.152: v68,45.35 68,49.35 69.5,50.85 OK1.6 | v53.5,24.35 55.5,26.35 v55.5,42.35
  Bottom 0.152: R8.2 87.5,42.35 84,45.85 68.5,45.85 v68,45.35 65,45.35 62,42.35 v55.5,42.35 | v53.5,24.35 42,24.35 42,22.85 41,21.85 39.5,21.85 38.5,20.85 IC4.11
N$36  (via drill 0.35)
  Top 0.152: R7.1 74.5,46.85 74,46.35 74,42.85 74.5,42.35 R8.1 74.5,41.85 v74.5,28.35
  Bottom 0.152: v74.5,28.35 86.5,28.35 92.5,22.35 IC6.12
N$37
  Bottom 0.152: OK1.2 67.5,43.85 68.5,44.85 74.5,44.85 R9.1
N$38
  Top 0.152: D4.C 68.5,53.85 67.5,54.85 67.5,57.35 SV1.3
  Bottom 0.152: R9.2 87.5,44.85 85,47.35 85,56.35 71.5,56.35 69,53.85 D4.C
N$39
  Bottom 0.152: IC3.12 49.5,51.35 48.5,52.35 25.5,52.35 24.5,51.35 C3.+
N$40
  Bottom 0.152: IC3.4 52,43.35 50,41.35 25,41.35 24.5,41.85 24.5,45.85 C4.+
N$41
  Top 0.305: C4.- C3.- TAPEOUT.1
N$42
  Top 0.152: IC3.3 49.5,43.85 47,46.35 47,50.85 IC3.13 46.5,51.35 46.5,54.35 44.5,56.35 | 44.5,56.35 43.5,57.35 SV4.4 | 44.5,56.35 37,48.85 37,24.35 36,23.35 IC4.10
N$43  (via drill 0.35)
  Top 0.152: v40.5,53.35 40.5,57.35 SV4.3
  Bottom 0.152: R2.2 27.5,50.85 26.5,49.85 23.5,49.85 22.5,50.85 22.5,53.35 v40.5,53.35 43,53.35 D1.C
N$44
  Bottom 0.152: IC4.36 38.44,35.91 39.5,34.85 42,34.85 42,36.35 43,37.35 44.5,37.35 44.5,38.85 45.5,39.85 61,39.85 65,35.85 92.14,35.85 95,32.98 95,15.35 93,13.35 91,13.35 91,15.15 IC6.10
N$46  (via drill 0.35)
  Top 0.152: 87.44,57.91 86.5,58.85 82.5,58.85 82.5,56.35 81.5,55.35 SV3.3 | 87.44,57.91 87.5,57.85 87.5,54.22 89.53,52.18 89.53,42.26 93.98,37.82 93.98,28.37 94,28.35 93,27.35 IC6.14 | 87.44,57.91 v87.63,58.11
  Bottom 0.152: v87.63,58.11 86.87,58.87 23.16,58.87 21.18,56.89 21.18,55.16 19.02,53 16.46,53 14.61,51.15 14.61,40.36 13.97,39.72 9.53,39.72 7.62,37.82 7.62,33.27 9.3,31.59 12.04,31.59 X1.3
N$47
  Top 0.152: SV3.7 86.36,54.36 89,51.72 89,20.85 85.5,17.35 IC6.7
  Bottom 0.152: IC6.7 83.67,15.44 69.49,15.44 65.08,11.02 65.08,10.71 62.03,7.67 37.03,7.67 34.59,10.1 34.59,10.41 33.53,11.47 27.43,11.47 26.98,11.02 26.98,10.71 25.76,9.49 19.96,9.49 19.36,10.1 19.36,10.41 16.31,13.46 16.31,17.42 15.24,18.13 15.24,21.3 13.34,23.21 11.79,23.21 10.97,24.02 10.97,27.33 9.6,28.7 9.6,30.07 X1.7
N$50
  Top 0.152: IC6.8 85,14.35 83.5,15.85 81.5,15.85 81.5,53.35 82.5,54.35 82.5,55.35 83.5,56.35 86,56.35 86,57.35 SV3.8
  Bottom 0.152: X1.8 9.6,32.96 9.6,34.18 10.97,35.55 10.97,37.59 12.47,39.09 14.61,39.09 15.24,39.72 15.24,46.07 17.78,48.61 18.41,48.61 19.05,49.25 20.32,49.25 21.49,50.64 21.49,56.74 23.32,58.57 85.19,58.57 86.26,57.5 SV3.8
N$51  (via drill 0.35)
  Top 0.152: v34.5,34.85 34.5,36.35 33.5,37.35 30.5,37.35 30.5,36.35 IC4.40
  Bottom 0.152: v34.5,34.85 35,34.35 44.5,34.35 44.5,36.35 45.5,37.35 48.5,37.35 49,36.85 59,36.85 62.5,33.35 75.5,33.35 78,30.85 94.5,30.85 94.5,17.35 93,15.85 93,14.35 IC6.9
N$52
  Top 0.152: R3.2 28,48.85 29,49.85 29,54.85 28,55.85 LED1.A
N$54  (via drill 0.35)
  Top 0.152: U$1.A26 25.4,9.18 24.46,10.12 24.46,10.9 25.01,11.45 25.1,11.45 v26.5,12.85
  Bottom 0.152: v26.5,12.85 25,14.35 19,14.35 18,15.35 IC7.1
N$55
  Top 0.305: IC7.3 23.47,16.2 23.47,39.07 23.73,39.33 23.76,39.41 23.86,39.46 24.43,40.04 24.43,43.3 26.67,45.53 26.67,58.13 27.3,58.77 33.02,58.77 33.66,57.5 SV4.1
VCC  (via drill 0.5)
  Top 0.152: R7.2 87.5,47.35 87.5,49.85 R6.2 | IC4.21 46,25.85 47,26.85 47,29.35 46,30.35 IC4.25 | 66,49.25 66,38.85 C7.1
  Top 0.305: U$1.A27 22.86,9.07 21.84,10.09 21.84,13.06 23.93,15.15 23.93,38.88 24.77,39.72 IC1.16 C9.1
  Top 0.61: C7.1 66.04,49.2 66,49.25 64.77,50.48 OK1.8
  Top 0.813: C7.1 66.04,35.91 IC2.14 | C5.+ v53.34,49.25 | IC4.44 28.57,32.1 v28.57,37.18 v28.57,43.53 | C6.1 C13.1
  Bottom 0.152: R7.2 88,46.85 88,45.85 89,44.85 89,38.85 84.5,38.85 83,37.35 C6.1 | 44.5,47.98 44.5,47.74 | OK1.7 67,51.35 65,51.35 OK1.8 | IC4.42 31.75,33.37 | 31.75,33.37 IC4.43 33.5,33.35 43,33.35 45.5,30.85 IC4.25 46.99,32.1 46.99,33.37 | 31.75,33.37 31.75,32.1 IC4.44 | IC4.41 31.93,35.91 30.91,36.94 28.82,36.94 v28.57,37.18 | 46.99,33.37 46.99,34.64 IC4.28 | IC4.26 46.99,33.37
  Bottom 0.813: C9.1 27.94,43.53 v28.57,43.53 C8.1 36.38,43.53 37.67,44.82 42.92,47.74 44.5,47.74 53.5,47.74 | 53.5,47.74 63.27,47.74 64.77,49.25 OK1.8 | C7.1 66.09,38.4 71.62,38.4 72.84,37.18 IC5.16 C6.1 | IC3.14 44.5,47.98 | IC6.16 91.78,33.07 91.43,33.42 87.12,33.42 85.91,34.64 C13.1 | 53.5,47.74 v53.34,49.25

### Text on the board
tNames: 5V(!) | 03/2019 | Tx-Rx-GND | + | + | + | + | ZX DUAL UART - ISS1b - ZX-TEAM holmatic